# EAGLE board cs_debug_v1 (EAGLE 9.6.1), part 1 of 2
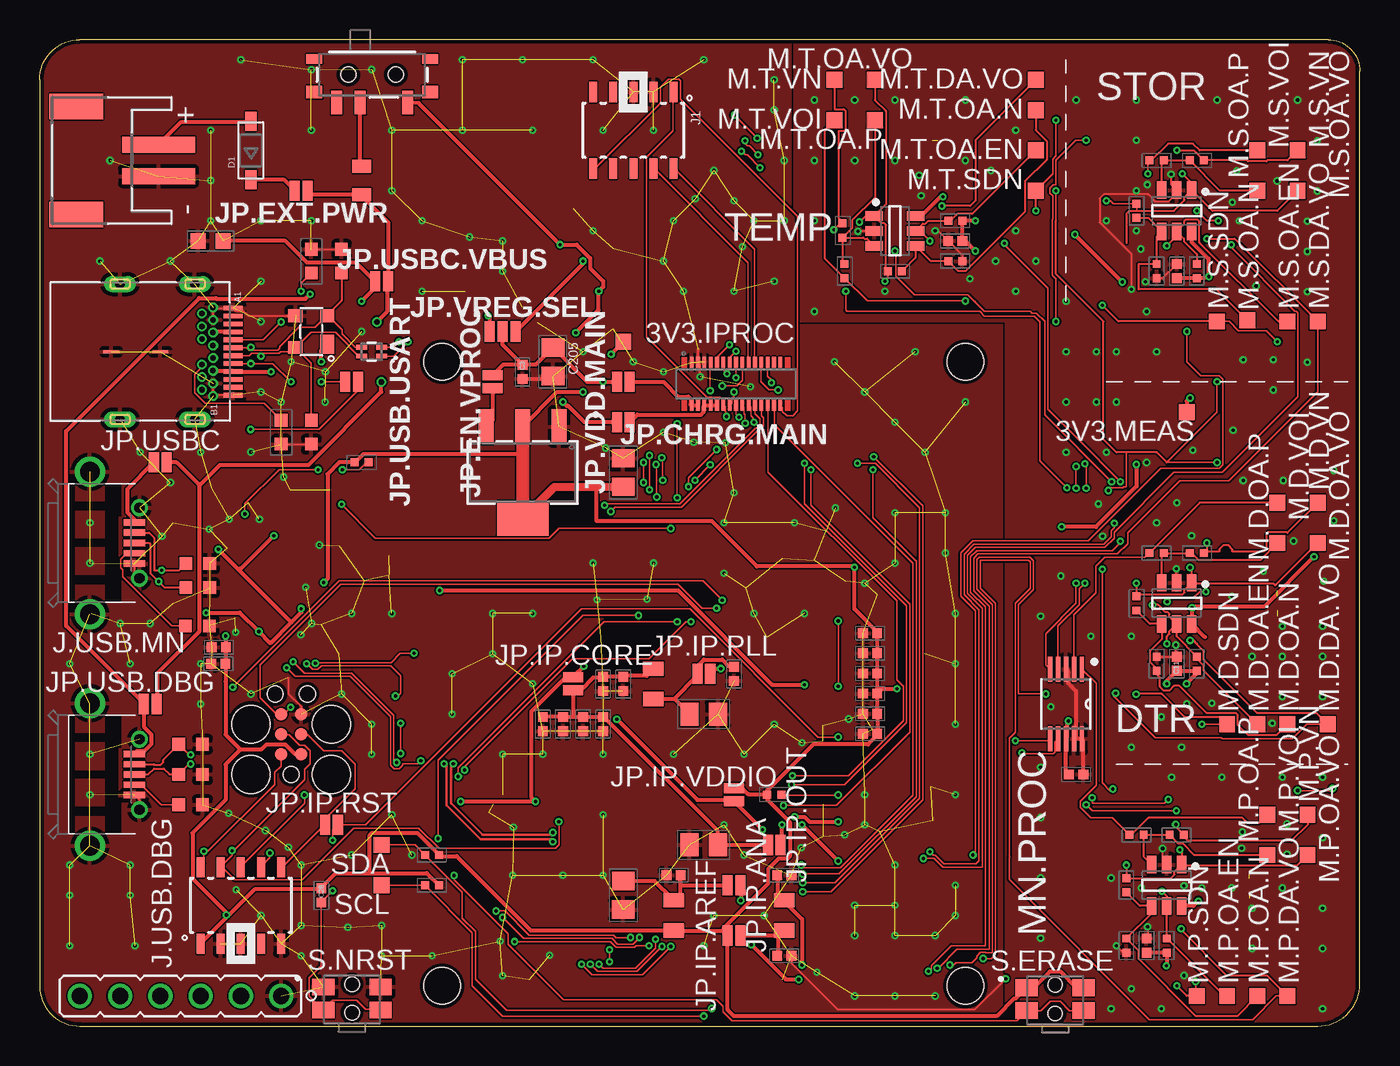
[diagram p9: board, top side]
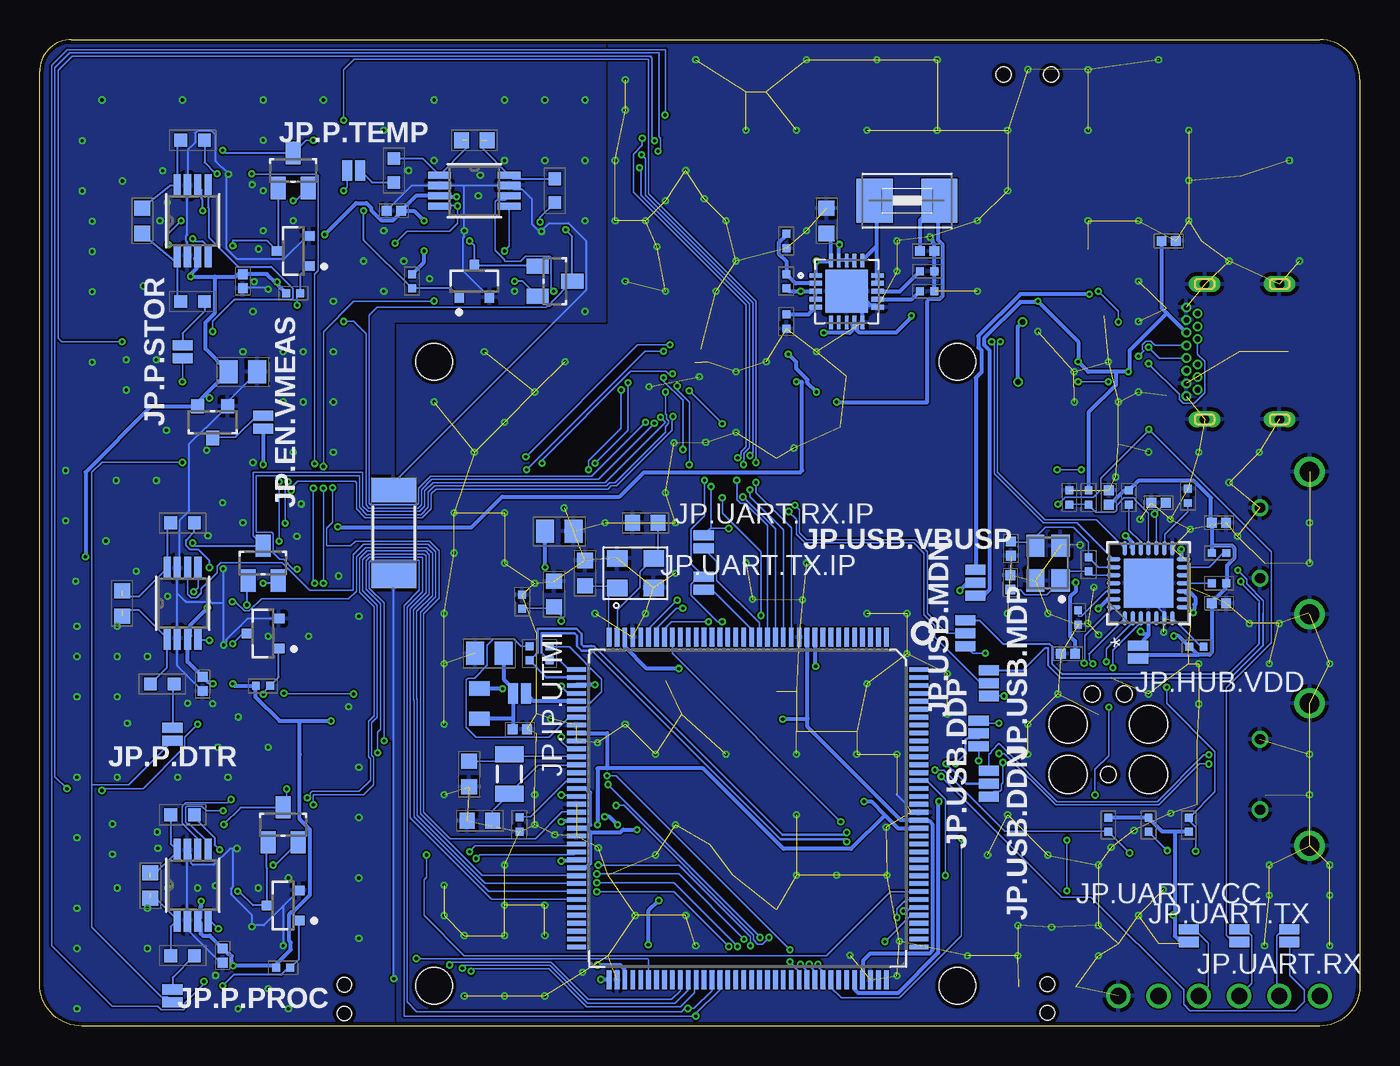
[diagram p10: board, bottom side, seen from below]

Size 83.31 x 62.23 mm. Coordinates in mm from the lower left corner, seen from the top.
Outline: 2.54,0 80.64,0 arc90 83.31,2.67 83.31,60.22 arc90 81.31,62.23 2.54,62.23 arc90 0,59.69 0,2.54 arc90 2.54,0
Copper layers (1*16): Top 0.035mm / dielectric 1.5mm / Bottom 0.035mm
Design rules "default *": minimum track width 4mil, minimum drill 0.2mm, track to track 4mil, track to pad 4mil, pad to pad 4mil, via to via 4mil, smd to smd 4mil, copper to edge 10mil, drill to drill 5mil, minimum pad ring 5mil, minimum via ring 5mil, stop-mask expansion 4mil, vias tented up to drill 0mil, thermal gap 10mil
Net classes: 1 power: width 0.254 mm; 2 power_5: width 0.254 mm; 5 10_mil: width 0.254 mm; 8 GND: width 0.127 mm
Holes 2.29 mm at 25.4,2.54 58.42,2.54 58.42,41.91 25.4,41.91
tKeepout: 4 lines

## Footprints (pad centres in the part's own frame; a part is rotated, then mirrored left to right if it is on the bottom)
TP10SQ = smd 1 x 1: TP 0,0
C0805 = smd 1.15 x 1.45: 1 -0.9,0; 2 0.9,0
C0402 = smd 0.62 x 0.62: 1 -0.45,0; 2 0.45,0
C0603 = smd 0.95 x 1: 1 -0.8,0; 2 0.8,0
SOD-123 = smd 1.2 x 0.7: A 1.85,0; C -1.85,0
SOT143_BGX50A = smd 1.2 x 0.9: 1 -0.8,-1 | smd 0.8 x 0.9: 2 1,-1; 3 1,1; 4 -1,1
1812 = smd 2.286 x 2.794: 1 -2.046,0; 2 2.046,0
SAMTECH_FTSH-105-01 = smd 0.508 x 1.27: 1 -2.54,-2.413; 2 -2.54,2.413; 3 -1.27,-2.413; 4 -1.27,2.413; 5 0,-2.413; 6 0,2.413; 7 1.27,-2.413; 8 1.27,2.413; 9 2.54,-2.413; 10 2.54,2.413
8.06.16_6-PIN_NEEDLE_ADAPTER_LEGS = smd 0.787 x 0.787: 1 -1.27,-0.635; 2 -1.27,0.635; 3 0,-0.635; 4 0,0.635; 5 1.27,-0.635; 6 1.27,0.635 | hole 0.991: -2.54,0; 2.54,1.015; 2.54,-1.015 | hole 2.375: -2.54,2.54; 0.635,2.54; 0.635,-2.54; -2.54,-2.54
HEADER-1X6 = drill 1.016: 1 0,-6.35; 2 0,-3.81; 3 0,-1.27; 4 0,1.27; 5 0,3.81; 6 0,6.35
632723X00011 = smd 0.3 x 1.2: A1 -2.75,4.58; A2 -2.25,4.58; A3 -1.75,4.58; A4 -1.25,4.58; A5 -0.75,4.58; A6 -0.25,4.58; A7 0.25,4.58; A8 0.75,4.58; A9 1.25,4.58; A10 1.75,4.58; A11 2.25,4.58; A12 2.75,4.58 | drill 0.35 pad 0.584: B1 2.8,3.33; B2 2.4,2.63; B3 1.6,2.63; B4 1.2,3.33; B5 0.8,2.63; B6 0.4,3.33; B7 -0.4,3.33; B8 -0.8,2.63; B9 -1.2,3.33; B10 -1.6,2.63; B11 -2.4,2.63; B12 -2.8,3.33; GND 2,3.33; GND1 -2,3.33 | drill 0.6 pad 1 long: Z1 -4.27,2.18; Z2 4.27,2.18; Z3 4.27,-2.55; Z4 -4.27,-2.55 | smd 0.2 x 1: Z5 0,0; Z6 0,-3.1
JST-PH-2-SMT-RA = smd 1 x 4.6: 1 1,-3.7; 2 -1,-3.7 | smd 1.6 x 3.4: NC1 -3.4,1.5; NC2 3.4,1.5
USB-THRU-ZX62D-AB-5P8 = smd 1.35 x 0.4: D+ 2.8,0; D- 2.8,0.65; GND 2.8,-1.3; USBID 2.8,-0.65; VBUS 2.8,1.3 | drill 1.25 pad 1.9: S1 0,-4.5; S2 0,4.5 | drill 0.65 pad 1.05: S3 3.125,2.225; S4 3.125,-2.225
HRS_DF40C-30DP-0.4V(51) = smd 0.23 x 0.7: 1 -2.8,1.355; 2 -2.8,-1.355; 3 -2.4,1.355; 4 -2.4,-1.355; 5 -2,1.355; 6 -2,-1.355; 7 -1.6,1.355; 8 -1.6,-1.355; 9 -1.2,1.355; 10 -1.2,-1.355; 11 -0.8,1.355; 12 -0.8,-1.355; 13 -0.4,1.355; 14 -0.4,-1.355; 15 0,1.355; 16 0,-1.355; 17 0.4,1.355; 18 0.4,-1.355; 19 0.8,1.355; 20 0.8,-1.355; 21 1.2,1.355; 22 1.2,-1.355; 23 1.6,1.355; 24 1.6,-1.355; 25 2,1.355; 26 2,-1.355; 27 2.4,1.355; 28 2.4,-1.355; 29 2.8,1.355; 30 2.8,-1.355
SMT-JUMPER_2_NC_PASTE_NO-SILK = smd 0.635 x 1.27: 1 -0.406,0; 2 0.406,0
SMT-JUMPER_2_NO_PASTEFREE_NO-SILK = smd 0.635 x 1.27: 1 -0.406,0; 2 0.406,0
SMT-JUMPER_3_1-NC_PASTE_NO-SILK = smd 0.635 x 1.27: 1 -0.813,0; 2 0,0; 3 0.813,0
0805 = smd 0.8 x 1.2: 1 -0.9,0; 2 0.9,0
IND_DLP11S_0504_MUR = smd 0.7 x 0.3: 1 -0.625,0.275; 2 0.625,0.275; 3 0.625,-0.275; 4 -0.625,-0.275
L0805 = smd 0.9 x 1.3: 1 -0.95,0; 2 0.95,0
SOT23-3_FDN340P = smd 0.95 x 1.4: D 0,1.1; G -0.95,-1.1; S 0.95,-1.1
SOT23-3_2N7002P = smd 0.6 x 0.7: D 0,1; G -0.95,-1; S 0.95,-1
R2010 = smd 1.499 x 2.794: 1 -2.667,0; 2 2.667,0
R0402 = smd 0.5 x 0.5: 1 -0.45,0; 2 0.45,0
R0603 = smd 0.8 x 0.8: 1 -0.75,0; 2 0.75,0
SWITCH_SPST_SMD_A = smd 0.7 x 1.5: 1 -2.25,-1.75; 2 -0.75,-1.75; 3 2.25,-1.75 | smd 1 x 0.6: GND1 -3.65,1; GND3 3.65,1 | smd 1 x 0.8: GND2 -3.65,-1.1; GND4 3.65,-1.1 | hole 0.95: -1.5,0; 1.5,0
SW_EVQ-P7L01P = smd 1.4 x 1.05: 1_1 -1.8,0.725; 1_2 1.8,0.725; 2_1 -1.8,-0.725; 2_2 1.8,-0.725 | hole 0.9: 0,-0.9; 0,0.9
SOT23-3_AP2120N = smd 0.8 x 0.9: GND -0.95,-1; IN 0,1; OUT 0.95,-1
DCY4 = smd 0.95 x 2.15: GND -2.3,-2.9; IN 2.3,-2.9; OUT 0,-2.9 | smd 3.25 x 2.15: OUT_TAB 0,2.9
DGK-MSOP8_INA225 = smd 1.45 x 0.45: GND -2.2,0.325; GS0 2.2,-0.975; GS1 2.2,-0.325; IN+ -2.2,0.975; IN- 2.2,0.975; OUT -2.2,-0.975; REF 2.2,0.325; VS -2.2,-0.325
OPA357AIDBVTG4 = smd 1.1 x 0.6: ENABLE 1.3,0; IN+ -1.3,-0.95; IN- 1.3,-0.95; OUT -1.3,0.95; VREF+ 1.3,0.95; VREF- -1.3,0
DGS10 = smd 1.575 x 0.279: 1 -2.2,1; 2 -2.2,0.5; 3 -2.2,0; 4 -2.2,-0.5; 5 -2.2,-1; 6 2.2,-1; 7 2.2,-0.5; 8 2.2,0; 9 2.2,0.5; 10 2.2,1
QFN50P400X400X100-21N = smd 0.81 x 0.26: 1 -1.955,1; 2 -1.955,0.5; 3 -1.955,0; 4 -1.955,-0.5; 5 -1.955,-1; 11 1.955,-1; 12 1.955,-0.5; 13 1.955,0; 14 1.955,0.5; 15 1.955,1 | smd 0.26 x 0.81: 6 -1,-1.955; 7 -0.5,-1.955; 8 0,-1.955; 9 0.5,-1.955; 10 1,-1.955; 16 1,1.955; 17 0.5,1.955; 18 0,1.955; 19 -0.5,1.955; 20 -1,1.955 | smd 2.7 x 2.7: 21 0,0
QFN28_5X5MC_MCH = smd 0.89 x 0.28: 1 -2.21,1.5; 2 -2.21,1; 3 -2.21,0.5; 4 -2.21,0; 5 -2.21,-0.5; 6 -2.21,-1; 7 -2.21,-1.5; 15 2.21,-1.5; 16 2.21,-1; 17 2.21,-0.5; 18 2.21,0; 19 2.21,0.5; 20 2.21,1; 21 2.21,1.5 | smd 0.28 x 0.89: 8 -1.5,-2.21; 9 -1,-2.21; 10 -0.5,-2.21; 11 0,-2.21; 12 0.5,-2.21; 13 1,-2.21; 14 1.5,-2.21; 22 1.5,2.21; 23 1,2.21; 24 0.5,2.21; 25 0,2.21; 26 -0.5,2.21; 27 -1,2.21; 28 -1.5,2.21 | smd 3.1 x 3.1: 29 0,0
LQFP144 = smd 0.3 x 1.2: 1 -8.75,-10.8; 2 -8.25,-10.8; 3 -7.75,-10.8; 4 -7.25,-10.8; 5 -6.75,-10.8; 6 -6.25,-10.8; 7 -5.75,-10.8; 8 -5.25,-10.8; 9 -4.75,-10.8; 10 -4.25,-10.8; 11 -3.75,-10.8; 12 -3.25,-10.8; 13 -2.75,-10.8; 14 -2.25,-10.8; 15 -1.75,-10.8; 16 -1.25,-10.8; 17 -0.75,-10.8; 18 -0.25,-10.8; 19 0.25,-10.8; 20 0.75,-10.8; 21 1.25,-10.8; 22 1.75,-10.8; 23 2.25,-10.8; 24 2.75,-10.8; 25 3.25,-10.8; 26 3.75,-10.8; 27 4.25,-10.8; 28 4.75,-10.8; 29 5.25,-10.8; 30 5.75,-10.8; 31 6.25,-10.8; 32 6.75,-10.8; 33 7.25,-10.8; 34 7.75,-10.8; 35 8.25,-10.8; 36 8.75,-10.8; 73 8.75,10.8; 74 8.25,10.8; 75 7.75,10.8; 76 7.25,10.8; 77 6.75,10.8; 78 6.25,10.8; 79 5.75,10.8; 80 5.25,10.8; 81 4.75,10.8; 82 4.25,10.8; 83 3.75,10.8; 84 3.25,10.8; 85 2.75,10.8; 86 2.25,10.8; 87 1.75,10.8; 88 1.25,10.8; 89 0.75,10.8; 90 0.25,10.8; 91 -0.25,10.8; 92 -0.75,10.8; 93 -1.25,10.8; 94 -1.75,10.8; 95 -2.25,10.8; 96 -2.75,10.8; 97 -3.25,10.8; 98 -3.75,10.8; 99 -4.25,10.8; 100 -4.75,10.8; 101 -5.25,10.8; 102 -5.75,10.8; 103 -6.25,10.8; 104 -6.75,10.8; 105 -7.25,10.8; 106 -7.75,10.8; 107 -8.25,10.8; 108 -8.75,10.8 | smd 1.2 x 0.3: 37 10.8,-8.75; 38 10.8,-8.25; 39 10.8,-7.75; 40 10.8,-7.25; 41 10.8,-6.75; 42 10.8,-6.25; 43 10.8,-5.75; 44 10.8,-5.25; 45 10.8,-4.75; 46 10.8,-4.25; 47 10.8,-3.75; 48 10.8,-3.25; 49 10.8,-2.75; 50 10.8,-2.25; 51 10.8,-1.75; 52 10.8,-1.25; 53 10.8,-0.75; 54 10.8,-0.25; 55 10.8,0.25; 56 10.8,0.75; 57 10.8,1.25; 58 10.8,1.75; 59 10.8,2.25; 60 10.8,2.75; 61 10.8,3.25; 62 10.8,3.75; 63 10.8,4.25; 64 10.8,4.75; 65 10.8,5.25; 66 10.8,5.75; 67 10.8,6.25; 68 10.8,6.75; 69 10.8,7.25; 70 10.8,7.75; 71 10.8,8.25; 72 10.8,8.75; 109 -10.8,8.75; 110 -10.8,8.25; 111 -10.8,7.75; 112 -10.8,7.25; 113 -10.8,6.75; 114 -10.8,6.25; 115 -10.8,5.75; 116 -10.8,5.25; 117 -10.8,4.75; 118 -10.8,4.25; 119 -10.8,3.75; 120 -10.8,3.25; 121 -10.8,2.75; 122 -10.8,2.25; 123 -10.8,1.75; 124 -10.8,1.25; 125 -10.8,0.75; 126 -10.8,0.25; 127 -10.8,-0.25; 128 -10.8,-0.75; 129 -10.8,-1.25; 130 -10.8,-1.75; 131 -10.8,-2.25; 132 -10.8,-2.75; 133 -10.8,-3.25; 134 -10.8,-3.75; 135 -10.8,-4.25; 136 -10.8,-4.75; 137 -10.8,-5.25; 138 -10.8,-5.75; 139 -10.8,-6.25; 140 -10.8,-6.75; 141 -10.8,-7.25; 142 -10.8,-7.75; 143 -10.8,-8.25; 144 -10.8,-8.75
XTAL_EPSON_TSX3225 = smd 1.4 x 1.15: 1 -1.1,-0.8; 2 1.1,-0.8; 3 1.1,0.8; 4 -1.1,0.8
CRYSTAL-SMD-3.2X1.5MM = smd 1 x 1.8: P$1 -1.25,0; P$2 1.25,0
CRYSTAL-3.2-2.5 = smd 1.3 x 1.05: 1 -1.15,-0.925; 2 1.15,-0.925; 3 1.15,0.925; 4 -1.15,0.925

## Placement (x,y rotation side)
3V3.IPROC  TPTP10SQ  [TP10SQ]  36.83,43.18 0 top
3V3.MEAS  TPTP10SQ  [TP10SQ]  72.39,38.73 180 top
C1  10u  [C0805]  70.48,41.27 0 bottom
C2  10u  [C0805]  36.83,34.92 90 top
C3  0.1u  [C0402]  30.48,41.27 270 top
C7  270nF  [C0603]  76.33,8.86 270 bottom
C8  0.1u  [C0402]  69.85,5.08 90 top
C9  0.1u  [C0402]  71.75,4.45 270 bottom
C10  270nF  [C0603]  78.1,26.67 270 bottom
C11  0.1u  [C0402]  71.75,22.86 90 top
C12  0.1u  [C0402]  73.03,21.59 270 bottom
C13  270nF  [C0603]  76.84,50.8 270 bottom
C14  0.1u  [C0402]  71.75,47.62 90 top
C15  0.1u  [C0402]  70.48,46.99 270 bottom
C16  0.1u  [C0402]  65.41,15.88 0 top
C17  16pF  [C0603]  45.09,31.75 180 bottom
C18  4.7u  [C0402]  27.3,48.9 0 bottom
C19  16pF  [C0603]  48.89,28.57 90 bottom
C20  270nF  [C0603]  55.88,55.88 180 bottom
C21  0.1u  [C0402]  57.78,49.53 180 top
C22  0.1u  [C0402]  46.99,4.45 0 top
C23  22u  [C0805]  41.91,11.43 180 top
C24  22u  [C0805]  41.91,19.68 0 top
C25  22u  [C0805]  36.83,8.26 270 top
C26  22u  [C0805]  54.94,23.52 180 bottom
C27  22u  [C0805]  50.52,31.22 0 bottom
C28  10n  [C0402]  17.78,8.26 270 top
C29  0.1u  [C0402]  46.99,9.53 0 top
C30  0.1u  [C0402]  36.83,21.59 270 top
C31  0.1u  [C0402]  35.56,21.59 270 top
C32  0.1u  [C0402]  34.29,19.05 270 top
C33  0.1u  [C0402]  33.02,19.05 270 top
C34  0.1u  [C0402]  31.75,19.05 270 top
C35  0.1u  [C0402]  35.56,19.05 270 top
C36  0.1u  [C0402]  43.81,22.23 270 top
C37  0.1u  [C0402]  52.4,18.44 180 top
C38  0.1u  [C0402]  52.4,19.71 180 top
C39  0.1u  [C0402]  52.4,24.79 180 top
C40  0.1u  [C0402]  52.4,23.52 180 top
C41  0.1u  [C0402]  52.4,22.25 180 top
C42  0.1u  [C0402]  52.4,20.98 180 top
C43  0.1u  [C0402]  53.01,18.72 0 bottom
C44  0.1u  [C0402]  40,9.53 180 top
C45  0.1u  [C0402]  60.96,51.44 180 bottom
C46  2.2uF  [C0603]  10.79,49.53 180 top
C47  1u  [C0402]  12.06,49.53 0 bottom
C48  0.1u  [C0402]  12.7,33.02 180 bottom
C49  0.1u  [C0402]  18.41,23.5 180 bottom
C50  0.1u  [C0402]  11.28,22.86 180 top
C51  0.1u  [C0402]  8.89,26.67 0 bottom
C52  0.1u  [C0402]  8.89,31.75 0 bottom
C53  0.1u  [C0402]  15.85,33.35 90 bottom
C54  4.7u  [C0402]  11.3,23.9 180 top
C55  18pF  [C0402]  22.05,27.99 90 bottom
C56  18pF  [C0402]  22.02,30.12 270 bottom
C103  16pF  [C0603]  55.52,12.95 180 bottom
C107  16pF  [C0603]  56.21,15.9 270 bottom
C108  10pF  [C0603]  50.85,27.25 90 bottom
C205  22u  [C0805]  32.38,41.91 270 top
C208  4.7u  [C0603]  33.66,50.8 90 bottom
D1  MBR120VLSFT3GOSCT-ND  [SOD-123]  13.33,55.24 90 top
D2  BGX50A  [SOT143_BGX50A]  17.14,43.81 90 top
F2  MF-MSMF050-2  [1812]  28.57,52.07 180 bottom
J1  J-JTAG-CORTEX_SMD  [SAMTECH_FTSH-105-01]  37.47,56.52 180 top
J2  J-JTAG-CORTEX_SMD  [SAMTECH_FTSH-105-01]  12.7,7.62 0 top
J3  J-JTAG-CORTEX-NEEDLE6-LEGS  [8.06.16_6-PIN_NEEDLE_ADAPTER_LEGS]  15.88,18.41 90 top
J4  J-SERIAL-PORT  [HEADER-1X6]  8.89,1.91 90 top
J5  J-WURTH-USBC  [632723X00011]  7.62,42.55 270 top
J19  Solar  [JST-PH-2-SMT-RA]  3.81,54.61 90 top
J.USB.DBG  J-USB-HIROSE-MICRO-USB  [USB-THRU-ZX62D-AB-5P8]  3.18,15.88 0 top
J.USB.MN  J-USB-HIROSE-MICRO-USB  [USB-THRU-ZX62D-AB-5P8]  3.18,30.48 0 top
J_DBG_TO_MAIN_HDR  HIROSE-DF40_30-PIN_CONNECTORS-HEADER  [HRS_DF40C-30DP-0.4V(51)]  43.94,40.51 0 top
JP.CHRG.MAIN  JUMPER-SMT_2_NC_PASTE_NO-SILK  [SMT-JUMPER_2_NC_PASTE_NO-SILK]  36.83,38.1 0 top
JP.EN.VMEAS  JUMPER-SMT_2_NC_PASTE_NO-SILK  [SMT-JUMPER_2_NC_PASTE_NO-SILK]  69.22,38.1 90 bottom
JP.EN.VPROC  JUMPER-SMT_2_NC_PASTE_NO-SILK  [SMT-JUMPER_2_NC_PASTE_NO-SILK]  28.57,40.64 270 top
JP.EXT.PWR  JUMPER-SMT_2_NC_PASTE_NO-SILK  [SMT-JUMPER_2_NC_PASTE_NO-SILK]  16.51,52.7 0 top
JP.HUB.VDD  JUMPER-SMT_2_NC_PASTE_NO-SILK  [SMT-JUMPER_2_NC_PASTE_NO-SILK]  14,23.6 90 bottom
JP.IP.ANA  JUMPER-SMT_2_NC_PASTE_NO-SILK  [SMT-JUMPER_2_NC_PASTE_NO-SILK]  43.81,8.89 180 top
JP.IP.AREF  JUMPER-SMT_2_NC_PASTE_NO-SILK  [SMT-JUMPER_2_NC_PASTE_NO-SILK]  43.81,5.71 0 top
JP.IP.CORE  JUMPER-SMT_2_NC_PASTE_NO-SILK  [SMT-JUMPER_2_NC_PASTE_NO-SILK]  33.66,21.59 270 top
JP.IP.OUT  JUMPER-SMT_2_NC_PASTE_NO-SILK  [SMT-JUMPER_2_NC_PASTE_NO-SILK]  46.36,11.43 180 top
JP.IP.PLL  JUMPER-SMT_2_NC_PASTE_NO-SILK  [SMT-JUMPER_2_NC_PASTE_NO-SILK]  41.91,22.23 180 top
JP.IP.RST  JUMPER-SMT_2_NC_PASTE_NO-SILK  [SMT-JUMPER_2_NC_PASTE_NO-SILK]  18.41,12.7 0 top
JP.IP.UTMI  JUMPER-SMT_2_NC_PASTE_NO-SILK  [SMT-JUMPER_2_NC_PASTE_NO-SILK]  53.04,20.98 180 bottom
JP.IP.VDDIO  JUMPER-SMT_2_NC_PASTE_NO-SILK  [SMT-JUMPER_2_NC_PASTE_NO-SILK]  43.81,14.61 90 top
JP.P.DTR  JUMPER-SMT_2_NC_PASTE_NO-SILK  [SMT-JUMPER_2_NC_PASTE_NO-SILK]  74.93,18.41 90 bottom
JP.P.PROC  JUMPER-SMT_2_NC_PASTE_NO-SILK  [SMT-JUMPER_2_NC_PASTE_NO-SILK]  74.93,1.91 90 bottom
JP.P.STOR  JUMPER-SMT_2_NC_PASTE_NO-SILK  [SMT-JUMPER_2_NC_PASTE_NO-SILK]  74.3,42.55 90 bottom
JP.P.TEMP  JUMPER-SMT_2_NC_PASTE_NO-SILK  [SMT-JUMPER_2_NC_PASTE_NO-SILK]  63.5,53.98 0 bottom
JP.UART.RX  JUMPER-SMT_2_NC_PASTE_NO-SILK  [SMT-JUMPER_2_NC_PASTE_NO-SILK]  4.45,5.71 90 bottom
JP.UART.RX.IP  JUMPER-SMT_2_NC_PASTE_NO-SILK  [SMT-JUMPER_2_NC_PASTE_NO-SILK]  41.4,30.56 270 bottom
JP.UART.TX  JUMPER-SMT_2_NC_PASTE_NO-SILK  [SMT-JUMPER_2_NC_PASTE_NO-SILK]  7.62,5.71 90 bottom
JP.UART.TX.IP  JUMPER-SMT_2_NC_PASTE_NO-SILK  [SMT-JUMPER_2_NC_PASTE_NO-SILK]  41.4,27.94 270 bottom
JP.UART.VCC  JUMPER-SMT_2_NC_PASTE_NO-SILK  [SMT-JUMPER_2_NC_PASTE_NO-SILK]  10.79,5.71 90 bottom
JP.USB.DBG  JUMPER-SMT_2_NO_PASTEFREE  [SMT-JUMPER_2_NO_PASTEFREE_NO-SILK]  6.98,20.32 180 top
JP.USB.DDN  JUMPER-SMT_3_1-NC_PASTE_NO-SILK  [SMT-JUMPER_3_1-NC_PASTE_NO-SILK]  23.42,15.29 270 bottom
JP.USB.DDP  JUMPER-SMT_3_1-NC_PASTE_NO-SILK  [SMT-JUMPER_3_1-NC_PASTE_NO-SILK]  24.05,18.47 270 bottom
JP.USB.MDN  JUMPER-SMT_3_1-NC_PASTE_NO-SILK  [SMT-JUMPER_3_1-NC_PASTE_NO-SILK]  24.89,24.79 270 bottom
JP.USB.MDP  JUMPER-SMT_3_1-NC_PASTE_NO-SILK  [SMT-JUMPER_3_1-NC_PASTE_NO-SILK]  23.42,21.64 270 bottom
JP.USB.USART  JUMPER-SMT_2_NC_PASTE_NO-SILK  [SMT-JUMPER_2_NC_PASTE_NO-SILK]  19.68,40.64 0 top
JP.USB.VBUSP  JUMPER-SMT_3_1-NC_PASTE_NO-SILK  [SMT-JUMPER_3_1-NC_PASTE_NO-SILK]  24.26,27.97 270 bottom
JP.USBC  JUMPER-SMT_2_NO_PASTEFREE  [SMT-JUMPER_2_NO_PASTEFREE_NO-SILK]  7.62,35.56 180 top
JP.USBC.VBUS  JUMPER-SMT_2_NC_PASTE_NO-SILK  [SMT-JUMPER_2_NC_PASTE_NO-SILK]  21.59,46.99 0 top
JP.VDD.MAIN  JUMPER-SMT_2_NC_PASTE_NO-SILK  [SMT-JUMPER_2_NC_PASTE_NO-SILK]  36.83,40.64 0 top
JP.VREG.SEL  JUMPER-SMT_3_1-NC_PASTE_NO-SILK  [SMT-JUMPER_3_1-NC_PASTE_NO-SILK]  29.21,43.81 0 top
L1  3.3µH/±20%/450mA  [0805]  20.32,53.34 90 top
L2  DLP11SN900HL2L  [IND_DLP11S_0504_MUR]  20.95,42.55 180 top
L101  MH2029-300Y  [L0805]  40,6.99 90 top
L102  MH2029-300Y  [L0805]  55.58,20.35 270 bottom
L103  MH2029-300Y  [L0805]  46.99,6.99 90 top
L104  MH2029-300Y  [L0805]  38.73,21.59 270 top
M.D.DA.VO  TPTP10SQ  [TP10SQ]  81.28,19.05 270 top
M.D.OA.EN  TPTP10SQ  [TP10SQ]  76.84,19.05 270 top
M.D.OA.N  TPTP10SQ  [TP10SQ]  78.74,19.05 270 top
M.D.OA.P  TPTP10SQ  [TP10SQ]  78.1,30.48 90 top
M.D.OA.VO  TPTP10SQ  [TP10SQ]  80.64,30.48 270 top
M.D.SDN  TPTP10SQ  [TP10SQ]  74.93,19.05 270 top
M.D.VN  TPTP10SQ  [TP10SQ]  80.64,33.02 270 top
M.D.VOI  TPTP10SQ  [TP10SQ]  78.1,33.02 270 top
M.P.DA.VO  TPTP10SQ  [TP10SQ]  78.74,1.91 90 top
M.P.OA.EN  TPTP10SQ  [TP10SQ]  74.93,1.91 0 top
M.P.OA.N  TPTP10SQ  [TP10SQ]  76.84,1.91 180 top
M.P.OA.P  TPTP10SQ  [TP10SQ]  77.47,10.79 90 top
M.P.OA.VO  TPTP10SQ  [TP10SQ]  80.01,10.79 90 top
M.P.SDN  TPTP10SQ  [TP10SQ]  73.03,1.91 270 top
M.P.VN  TPTP10SQ  [TP10SQ]  80.01,13.34 0 top
M.P.VOI  TPTP10SQ  [TP10SQ]  77.47,13.34 270 top
M.S.DA.VO  TPTP10SQ  [TP10SQ]  80.64,44.45 90 top
M.S.OA.EN  TPTP10SQ  [TP10SQ]  78.74,44.45 90 top
M.S.OA.N  TPTP10SQ  [TP10SQ]  76.2,44.53 90 top
M.S.OA.P  TPTP10SQ  [TP10SQ]  76.84,52.7 90 top
M.S.OA.VO  TPTP10SQ  [TP10SQ]  79.38,52.7 90 top
M.S.SDN  TPTP10SQ  [TP10SQ]  74.3,44.45 270 top
M.S.VN  TPTP10SQ  [TP10SQ]  79.38,55.24 270 top
M.S.VOI  TPTP10SQ  [TP10SQ]  76.84,55.24 90 top
M.T.DA.VO  TPTP10SQ  [TP10SQ]  62.87,59.69 180 top
M.T.OA.EN  TPTP10SQ  [TP10SQ]  62.87,55.24 180 top
M.T.OA.N  TPTP10SQ  [TP10SQ]  62.87,57.78 0 top
M.T.OA.P  TPTP10SQ  [TP10SQ]  52.7,57.15 180 top
M.T.OA.VO  TPTP10SQ  [TP10SQ]  52.7,59.69 0 top
M.T.SDN  TPTP10SQ  [TP10SQ]  62.87,52.7 0 top
M.T.VN  TPTP10SQ  [TP10SQ]  50.16,59.69 180 top
M.T.VOI  TPTP10SQ  [TP10SQ]  50.16,57.15 0 top
Q3  FDN340P  [SOT23-3_FDN340P]  67.94,12.7 0 bottom
Q4  2N7002P  [SOT23-3_2N7002P]  67.94,7.62 90 bottom
Q5  FDN340P  [SOT23-3_FDN340P]  67.31,53.98 0 bottom
Q6  2N7002P  [SOT23-3_2N7002P]  67.31,48.9 90 bottom
Q7  FDN340P  [SOT23-3_FDN340P]  69.22,29.21 0 bottom
Q8  2N7002P  [SOT23-3_2N7002P]  69.22,24.77 90 bottom
Q9  FDN340P  [SOT23-3_FDN340P]  50.8,46.99 270 bottom
Q10  2N7002P  [SOT23-3_2N7002P]  55.88,46.99 0 bottom
R1  0  [R2010]  60.96,31.11 90 bottom
R2  100k  [R0402]  10.79,12.7 270 bottom
R3  100k  [R0402]  13.33,12.7 90 bottom
R4  4.7k  [R0402]  24.77,8.89 180 top
R5  4.7k  [R0402]  24.77,10.79 180 top
R6  100k  [R0402]  15.88,12.7 90 bottom
R7  1M  [R0402]  17.12,29.13 270 bottom
R8  100k  [R0402]  53.04,12.73 270 bottom
R16  249k  [R0402]  69.22,12.06 0 top
R17  10k  [R0402]  71.75,12.06 180 top
R18  100k  [R0402]  71.12,5.08 270 top
R19  10k  [R0402]  68.58,8.89 90 top
R20  249k  [R0402]  68.58,5.08 90 top
R21  10k  [R0402]  67.94,3.68 180 bottom
R22  5.1  [R0603]  74.3,13.34 180 bottom
R23  5.1  [R0603]  74.3,4.45 180 bottom
R24  249k  [R0402]  70.48,54.61 0 top
R25  249k  [R0402]  70.48,29.84 0 top
R26  10k  [R0402]  73.03,29.84 180 top
R27  100k  [R0402]  73.03,22.86 270 top
R28  10k  [R0402]  69.22,26.67 90 top
R29  249k  [R0402]  70.48,22.86 270 top
R30  10k  [R0402]  69.22,21.46 180 bottom
R31  5.1  [R0603]  74.3,31.75 180 bottom
R32  5.1  [R0603]  75.56,21.59 180 bottom
R33  10k  [R0402]  73.03,54.61 180 top
R34  100k  [R0402]  73.03,47.62 270 top
R35  10k  [R0402]  69.22,51.44 90 top
R36  249k  [R0402]  70.48,47.62 90 top
R37  10k  [R0402]  67.31,46.23 180 bottom
R38  5.1  [R0603]  73.66,55.88 180 bottom
R39  5.1  [R0603]  73.66,45.72 180 bottom
R40  249k  [R0402]  50.8,47.62 90 top
R41  100k  [R0402]  46.36,14.61 0 top
R42  5.1k  [R0603]  17.14,48.26 270 top
R43  5.1k  [R0603]  15.24,37.47 90 top
R44  10k  [R0402]  8.89,27.94 0 bottom
R45  10k  [R0402]  10.31,23.93 180 bottom
R46  100k  [R0402]  18.34,33.35 270 bottom
R47  100k  [R0402]  17.12,33.35 90 bottom
R48  12k  [R0402]  17.78,25.78 90 bottom
R49  100k  [R0402]  20.32,35.56 180 top
R50  100k  [R0402]  10.85,33.45 270 bottom
R51  10k  [R0402]  14.58,33.35 90 bottom
R52  10k  [R0402]  8.89,29.84 180 bottom
R53  10k  [R0402]  50.67,50.19 270 top
R54  100k  [R0402]  57.78,50.8 0 top
R55  10k  [R0402]  53.97,47.62 180 top
R56  249k  [R0402]  57.78,48.26 180 top
R57  10k  [R0402]  59.82,46.99 90 bottom
R58  5.1  [R0603]  50.8,52.7 90 bottom
R59  5.1  [R0603]  60.96,53.98 90 bottom
R101  39  [R0402]  52.4,23.52 90 bottom
R102  39  [R0402]  51.13,23.52 90 bottom
R103  6.8k  [R0402]  52.86,26.77 270 bottom
R201  270k  [R0402]  36.2,46.99 270 bottom
R202  100k  [R0402]  36.2,49.53 90 bottom
R203  2k  [R0402]  27.3,47.62 180 bottom
R204  100k  [R0402]  27.3,46.35 180 bottom
R206  10k  [R0402]  36.2,44.45 90 bottom
S201  [SWITCH_SPST_SMD_A]  20.98,60.02 0 top
S.ERASE  Momentary  [SW_EVQ-P7L01P]  64.08,1.7 0 top
S.NRST  Momentary  [SW_EVQ-P7L01P]  19.71,1.75 0 top
SCL  TPTP10SQ  [TP10SQ]  21.59,8.89 180 top
SDA  TPTP10SQ  [TP10SQ]  21.59,11.43 180 top
U1  AP2120N-3.3TRG1  [SOT23-3_AP2120N]  72.39,38.1 180 bottom
U2  TLV1117LV33DCYR  [DCY4]  30.48,34.92 180 top
U5  INA225AIDGK  [DGK-MSOP8_INA225]  73.66,8.89 90 bottom
U6  OPA357AIDBVTG4  [OPA357AIDBVTG4]  71.12,8.89 270 top
U7  INA225AIDGK  [DGK-MSOP8_INA225]  74.3,26.67 90 bottom
U8  OPA357AIDBVTG4  [OPA357AIDBVTG4]  71.75,26.67 270 top
U9  INA225AIDGK  [DGK-MSOP8_INA225]  73.66,50.8 90 bottom
U10  OPA357AIDBVTG4  [OPA357AIDBVTG4]  71.75,51.44 270 top
U11  DAC7574IDGS  [DGS10]  64.77,20.32 270 top
U12  MCP73871T-2CCI/ML  [QFN50P400X400X100-21N]  32.38,46.35 0 bottom
U13  USB2412-DZK  [QFN28_5X5MC_MCH]  13.33,27.94 90 bottom
U14  INA225AIDGK  [DGK-MSOP8_INA225]  55.88,52.7 0 bottom
U15  OPA357AIDBVTG4  [OPA357AIDBVTG4]  53.97,50.16 0 top
U_INSTR_PROC  ATSAM3X8EA-AU  [LQFP144]  38.63,13.74 180 bottom
VR1  VARISTOR  [R0603]  9.52,13.97 0 top
VR2  VARISTOR  [R0603]  9.52,15.88 0 top
VR3  VARISTOR  [R0603]  19.05,48.26 90 top
VR4  VARISTOR  [R0603]  17.14,37.47 270 top
VR5  VARISTOR  [R0603]  9.52,17.78 0 top
VR6  VARISTOR  [R0603]  9.96,25.25 0 top
VR7  VARISTOR  [R0603]  9.98,27.66 0 top
VR8  VARISTOR  [R0603]  9.98,29.18 0 top
Y1  EPSON_TSX-3225_24.0000MF10Z-C3  [XTAL_EPSON_TSX3225]  19.68,29.21 90 bottom
Y101  32.768kHz  [CRYSTAL-SMD-3.2X1.5MM]  53.67,15.9 270 bottom
Y102  12mHz-12pF-K7  [CRYSTAL-3.2-2.5]  45.72,28.57 0 bottom

## Tracks (layer width: path | path; a pad name or v marks a point on that pad's centre or on a via)
3V3_INSTR_MEAS  (via drill 0.2)
  Top 0.254: U10.VREF+ 72.7,49.47 73.76,48.41 73.76,47.41 | 73.76,47.41 73.56,47.22 73.03,47.22 R34.2 C14.1 | 73.76,47.41 73.77,47.4 v73.77,47.29 | C8.1 R18.2 71.12,3.84 v71.09,3.81 | v73.12,7.89 72.82,7.59 U6.VREF+ | R27.2 C11.1 71.12,21.77 v71.12,21.59 | R27.2 73.03,22.45 | 73.53,24.55 U8.VREF+ 72.72,25.39 v72.72,26.39 72.8,26.47 77.27,26.47 v80.42,29.62 | R27.2 73.03,22.26 v72.37,21.61 | v59.05,48.9 58.42,49.53 C21.1 R54.2 v59.05,50.8 | C16.1 64.77,16.06 U11.8 64.82,18.24 64.82,19.15 v64.92,19.25 | v57,52.32 56.84,52.32 55.68,51.16 55.32,51.16 U15.VREF+ | 3V3.MEAS.TP 72.39,39.42 v72.59,39.62 | v68.33,46.94 v65.33,49.94
  Bottom 0.254: 73.51,48.43 U9.VS 73.46,48.41 73.41,48.33 73.41,47.79 73.77,47.43 v73.77,47.29 72.24,47.29 | R37.2 68.4,46.87 | 68.4,46.87 68.97,47.44 C15.1 70.64,47.59 70.94,47.29 72.24,47.29 | v71.09,3.81 71.1,3.83 | 71.1,3.83 71.19,3.91 71.19,4.41 71.34,4.56 71.42,4.56 C9.1 72.57,5.71 73.02,5.71 73.16,5.86 73.16,6.52 U5.VS 73.16,6.86 73.16,7.52 73.12,7.57 v73.12,7.89 | 71.1,3.83 68.54,3.83 R21.2 68.43,3.86 67.46,4.83 67.46,5.28 67.56,5.38 67.56,7.06 67.41,7.21 67.31,7.21 66.24,8.28 66.24,12.39 66.9,13.06 66.9,17.14 66.9,19.25 | v71.12,21.59 70.99,21.46 R30.2 69.7,21.39 69.7,20.78 68.17,19.25 66.9,19.25 | v72.72,26.39 v72.72,26.38 73.8,25.3 73.8,24.64 U7.VS 73.97,22.98 C12.1 72.69,21.7 72.61,21.7 72.51,21.61 v72.37,21.61 | R57.2 59.05,48.2 v59.05,48.9 | C45.1 59.56,52.38 U14.VS 57.96,52.32 v57,52.32 | C45.1 59.69,51.44 v59.05,50.8 | 66.9,19.25 v64.92,19.25 | 72.82,39.85 71.42,41.25 C1.1 71.48,41.35 72.85,42.72 72.85,44.4 72.24,45.01 72.24,47.29 | 72.82,39.85 73.3,39.37 73.3,39.12 U1.OUT 73.46,39.06 76.3,39.06 80.42,34.95 v80.42,29.62 | 72.82,39.85 v72.59,39.62 | v65.33,49.94 63.35,51.92 62.69,51.92 62.38,51.61 62.38,51.46 61.77,50.85 61.01,50.85 60.6,51.26 60.6,51.36 C45.1 | v68.33,46.94 68.4,46.87
3V3_INSTR_PROC  (via drill 0.2)
  Top 0.254: S.ERASE.1_2 65.43,2.43 64.43,3.43 63.74,3.43 62.73,2.43 S.ERASE.1_1 61.59,1.73 61.49,1.73 60.39,0.64 43.81,0.64 43.41,1.04 JP.IP.AREF.1 | U2.OUT 32.66,40.01 v34.29,40.01 | 3V3.IPROC.TP 36.83,43.16 v36.07,42.39 | U2.OUT_TAB 30.48,31.11 | JP.IP.AREF.1 43.13,5.99 40.03,5.99 L101.1 39.88,6.04 30.99,6.04 26.31,10.72 25.3,10.72 R5.1 25.2,10.82 23.82,12.19 20.98,12.19 20.83,12.04 20.83,9.65 | R41.1 45.87,14.63 44.7,14.63 44.35,14.99 43.84,14.99 JP.IP.VDDIO.2 | C42.1 52.88,20.98 52.88,19.81 C38.1 52.88,19.71 52.88,18.44 C37.1 52.83,18.34 52.27,17.78 48.82,17.78 45.92,14.88 45.92,14.73 R41.1 | C42.1 52.88,21.08 52.88,22.25 C41.1 52.88,22.35 52.88,23.52 C40.1 52.88,23.62 52.88,24.79 C39.1 52.83,24.89 51.41,26.31 v51.41,28.96 51.31,29.01 45.26,29.01 42.42,31.85 35.15,31.85 35.15,34.02 | v54.1,21.29 52.98,21.29 C42.1 | JP.IP.AREF.1 43.18,6.1 43.18,6.2 45.97,8.99 45.97,9.91 46.63,10.57 47.19,10.57 47.35,10.72 47.35,12.85 45.92,14.28 45.92,14.48 R41.1 | 20.83,9.65 18.69,9.65 17.78,8.74 C28.1 17.68,8.64 13.56,8.64 11.86,6.93 | 20.83,9.65 24.43,9.65 25.2,8.89 R4.1 | 11.86,6.93 10.16,5.23 J2.1 | 11.86,6.93 v11.79,7.01 11.73,7.11 11.73,7.21 9.65,9.3 9.65,12.19 11.73,14.28 11.73,16.51 12.6,17.37 12.65,17.48 | 30.48,36.07 20.42,36.07 19.91,35.56 R49.2 18.9,35.56 18.16,34.82 18.16,28.22 v17.93,27.99 17.88,27.89 | 12.65,17.48 14.02,17.48 14.33,17.78 15.49,17.78 16.1,17.17 16.51,17.17 J3.1 | 12.65,17.48 11.73,18.39 11.73,21.74 11.73,21.75 C50.1 11.75,22.89 C54.1 11.73,23.92 v11.73,24.61
  Top 0.508: U2.OUT_TAB 32.48,34.02 35.15,34.02 C2.1
  Top 0.813: U2.OUT 30.48,36.07 U2.OUT_TAB
  Bottom 0.254: v34.29,40.01 34.85,40.56 34.85,40.76 35.56,41.47 35.56,41.88 v36.07,42.39 | v54.1,21.29 55.58,21.29 L102.1 | v51.41,28.96 51.41,31.2 C27.1 | 11.68,12.29 12.5,12.29 13.31,13.11 R3.2 13.46,13.16 15.85,13.16 R6.2 | 11.68,12.29 10.82,12.29 R2.2 | 11.68,12.29 11.68,7.01 | 11.68,7.01 11.68,5.69 11.33,5.33 10.82,5.33 JP.UART.VCC.1 | v11.79,7.01 11.68,7.01 | C51.1 9.3,26.67 9.3,26.77 8.48,27.58 8.48,27.94 R44.2 8.38,28.04 8.38,29.06 7.92,29.52 7.92,30.18 8.08,30.33 9.35,30.33 | 9.4,26.82 C51.1 | C53.1 15.85,32.92 15.75,32.92 14.88,33.78 14.58,33.78 R51.2 13.99,34.39 10.46,34.39 9.4,33.33 9.4,31.85 C52.1 9.35,30.33 | 9.35,30.33 9.35,29.87 R52.2 9.45,29.77 | 10.21,23.42 10.67,23.88 R45.2 11.45,24.61 v11.73,24.61 | 10.21,23.42 9.5,23.42 9.35,23.57 9.35,26.57 C51.1 | v17.93,27.99 17.93,27.43 18.29,27.08 18.29,24.59 17.98,24.28 17.98,23.52 C49.1 | JP.HUB.VDD.1 13.77,23.42 10.21,23.42
ADVREF  (via drill 0.2)
  Top 0.254: C29.1 46.58,9.5 46.58,8.38 46.99,7.98 L103.2 47.04,7.82 48.11,6.76 v48.11,3.86
  Bottom 0.254: v48.11,3.86 46.69,3.86 46.43,3.61 46.43,2.95 U_INSTR_PROC.75
ADVREF_PRE
  Top 0.254: C22.1 46.58,4.47 46.58,5.59 46.99,5.99 L103.1 46.53,5.69 44.25,5.69 JP.IP.AREF.2
AGND  (via drill 0.2)
  Top 0.127: C14.2 70.85,47.17 R36.1 | v71.4,53.75 71.4,53.09 U10.VREF- 71.73,52.68 71.73,52.53 71.22,52.02 70.41,52.02 69.95,52.48 67.16,52.48 66.9,52.22 66.9,50.7 68.88,48.72 v68.88,46.48 | v67.94,5.08 68.39,4.63 R20.1 | v69.92,6.28 69.92,5.6 C8.2 69.85,5.61 | U6.VREF- 70.87,10.44 v70.87,11.2 | R29.1 C11.2 71.7,23.36 v71.7,24.04 | U8.VREF- 71.73,28 v71.73,28.85 | U15.VREF- 52.64,50.13 v51.63,50.13 | R56.1 58.23,48.63 C21.2 56.7,50.16 v56.52,50.16
  Top 0.254: C16.2 65.85,18.04 U11.10 65.41,18.12 | 65.41,18.12 U11.9 | U11.3 64.9,22.39 64.9,21.64 65.41,21.14 65.41,18.12
  Bottom 0.127: Q4.S 67.94,7.57 | 67.94,7.57 v67.94,5.08 | 67.94,7.57 69.16,6.35 69.85,6.35 v69.92,6.28 69.92,7.02 71.23,8.34 71.23,8.68 71.12,8.79 71.12,11.2 | v70.87,11.2 71.12,11.2 | 71.12,11.2 71.29,11.2 72.32,10.18 73.64,10.18 73.75,10.29 73.75,10.86 U5.REF U5.GND 73.97,6.66 73.97,6.1 71.88,4.01 71.78,4.01 C9.2 | 74.62,27.3 U7.GND 74.62,22.73 C12.2 | 74.62,27.3 U7.REF 74.57,28.91 74.47,29.01 74.47,31.9 73.86,32.51 73.86,36.73 72.85,37.74 72.8,37.74 71.48,39.06 U1.GND 71.42,39.12 71.42,39.42 69.6,41.25 C1.2 | v71.7,24.04 71.75,24.04 71.73,24.07 | 71.73,24.07 71.54,24.25 71.54,24.36 70.18,25.71 Q8.S | v71.73,28.85 71.73,26.67 | 71.73,26.67 71.73,24.07 | 71.73,26.67 72.41,26.67 72.55,26.81 72.57,26.78 74.1,26.78 74.12,26.81 74.62,27.3 | 56.52,53.03 U14.GND 59.81,53.03 C45.2 | 56.52,53.03 U14.REF 53.45,52.8 52.88,52.8 52.26,52.18 52.26,50.6 51.79,50.13 v51.63,50.13 51.61,50.19 51.16,50.65 49.94,50.65 48.82,49.53 48.82,46.43 60.96,34.29 R1.2 | 56.52,53.03 v56.52,50.16 56.52,49.78 56.6,49.7 56.6,47.66 Q10.S | U9.GND 73.98,49.45 74.05,49.52 74.05,49.84 73.98,49.91 U9.REF 73.97,53.03 73.97,55.27 73.51,55.73 73.51,56.34 73.35,56.49 72.44,56.49 72.19,56.24 72.19,54.56 71.42,53.8 v71.4,53.75 71.42,53.75 71.53,53.65 71.53,49.07 70.87,48.41 67.87,48.41 66.45,49.84 66.34,49.84 Q6.S | v68.88,46.48 69.01,46.61 70.44,46.61 C15.2
  other vias: 48.89,45.09 53.34,46.35 58.7,47.14 61.59,46.35 60.33,48.26 61.59,50.16 62.87,48.26 55.63,52.37 55.5,53.67 48.89,50.8 48.89,54.61 48.89,58.42 51.44,58.42 51.44,54.61 53.97,54.61 53.97,58.42 58.42,58.42 58.42,54.61 60.02,53.98 61.59,56.52 65.41,58.42 69.22,58.42 74.3,58.42 79.38,58.42 69.22,55.88 69.22,52.7 69.22,50.16 67.31,50.8 64.77,45.72 64.77,42.55 64.77,39.37 64.77,36.2 67.31,36.2 66.67,39.37 66.67,42.55 67.94,42.55 70.48,42.55 67.94,39.37 69.85,35.56 71.75,33.02 70.48,31.75 67.08,30.91 63.17,25.86 63.8,20.14 63.17,16.33 63.17,13.16 63.17,9.35 63.17,5.54 67.61,1.09 70.79,1.09 68.88,2.36 72.21,3.2 80.95,1.09 80.95,4.9 76.5,4.9 76.5,7.44 80.95,7.44 78.41,8.71 75.23,8.71 72.21,8.86 69.52,8.71 73.33,8.71 67.61,9.35 75.9,12.24 75.84,11.23 78.71,10.85 78.71,12.75 80.95,11.89 80.95,15.7 78.41,15.7 74.6,15.7 71.42,15.7 68.88,17.6 72.06,17.6 70.79,19.51 72.39,20.35 77.77,19.1 73.96,20.37 78.41,20.78 78.41,23.32 78.41,25.22 80.95,25.22 80.95,23.32 80.95,20.78 76.5,23.32 75.23,27.13 68.88,24.59 66.34,24.59 64.44,28.4 72.69,30.94 77.22,28.7 79.12,30.61 81.03,28.07 81.66,31.88 81.66,35.05 78.49,34.42 75.95,34.42 75.31,37.59 72.77,36.32 77.85,40.13 77.85,42.04 75.95,42.04 79.98,41.88 79.98,46.33 79.98,48.87 79.98,50.77 80.62,52.68 80.62,55.85 78.08,53.31 75.54,53.95 69.9,53.09 69.49,49.02 76.76,46.69 69.85,45.09 75.72,50.8 75.26,51.97 69.77,46.96 66.8,32.94
  pour Top: 60.96,0 83.19,0 83.19,62.23 47.62,62.23 47.62,44.45 60.96,44.45
  pour Bottom: 60.96,0 83.19,0 83.19,62.23 47.62,62.23 47.62,44.45 60.96,44.45
BAT_CHG_PROG1
  Bottom 0.254: U12.13 29.02,46.35 R203.2
CC3  (via drill 0.2)
  Top 0.102: J5.A5 14.11,43.3 v15.24,44.42 | v16.51,46.35 16.51,46.88 R42.2
  Bottom 0.102: v15.24,44.42 15.24,45.09 v16.51,46.35
CC4
  Top 0.102: J5.B5 10.25,41.59 9.8,41.13 9.8,39.96 10.46,39.29 14.16,39.29 R43.2
CHG_VPCC
  Bottom 0.254: R202.2 36.2,49.9 36.67,49.42 36.67,48.73 36.2,48.26 R201.1 35.61,46.85 U12.2
CM_DIFFAMP_N1  (1 unrouted)
  Bottom 0.127: 55.43,55.88 55.43,55.43 U14.IN- 53.45,53.45 R58.2
CM_DIFFAMP_N2
  Bottom 0.127: R38.2 74.63,55.66 U9.IN- 75.09,53 C13.1
CM_DIFFAMP_N3  (1 unrouted)
  Bottom 0.127: 78.1,27.12 77.02,27.12 U7.IN- 75.27,31.52 R31.2
CM_DIFFAMP_N4  (1 unrouted)
  Bottom 0.127: R22.2 75.05,11.5 U5.IN- 74.63,11.01 76.33,9.31
CM_DIFFAMP_P1  (1 unrouted)
  Bottom 0.127: R59.2 59.12,54.73 U14.IN+ 56.33,55.43 56.33,55.88
CM_DIFFAMP_P2
  Bottom 0.127: U9.IN+ 74.63,48.26 | 74.63,48.26 74.63,45.95 R39.2 | C13.2 74.75,48.26 74.63,48.26
CM_DIFFAMP_P3  (1 unrouted)
  Bottom 0.127: 78.1,26.22 77.02,26.22 U7.IN+ 75.27,22.64 R32.2
CM_DIFFAMP_P4  (1 unrouted)
  Bottom 0.127: 76.33,8.41 74.63,6.72 U5.IN+ 75.05,6.28 R23.2
CM_DTR_DCBIAS_SHUTDOWN  (via drill 0.2)
  Top 0.102: M.D.SDN.TP v73.33,19.05 | v79.38,14.86 81.35,14.86 81.41,14.81 v81.59,14.99 | v38.94,33.38 38.94,35.43 v38.89,35.43 | v45.47,54.15 44.65,54.97 44.53,54.97 v44.3,55.19
  Top 0.127: v69.19,20.93 69.22,20.95 70.81,20.95 72.27,19.49 74.49,19.49 M.D.SDN.TP
  Bottom 0.102: v73.33,19.05 74.14,18.24 74.14,17.63 76.78,14.99 79.25,14.99 v79.38,14.86 | v81.59,14.99 82.35,15.75 82.35,60.45 81.41,61.39 44.22,61.39 | 44.2,61.39 44.22,61.39 | v38.94,33.38 38.89,33.38 36.88,31.37 U_INSTR_PROC.15 | v38.89,35.43 38.86,35.46 38.86,36.15 38.53,36.48 38.53,45.58 45.36,52.41 45.36,54.05 v45.47,54.15 | 44.22,61.39 44.22,56.11 44.12,56.01 44.12,55.37 v44.3,55.19
  Bottom 0.127: Q8.G 68.22,22.01 R30.1 69.19,21.03 v69.19,20.93
CM_DTR_DIFFAMP_GAIN0  (via drill 0.2)
  Top 0.102: v71.14,26.77 71.39,27.01 72.81,27.01 73.21,27.41 v73.58,27.41
  Bottom 0.102: U_INSTR_PROC.64 49.46,9.02 55.2,9.02 59.49,13.3 59.49,20.63 59.51,20.66 59.51,26.17 58.52,27.16 58.52,29.83 58.88,30.19 62.73,30.19 63.32,29.6 63.32,27.43 63.8,26.95 69.31,26.95 70.07,26.19 70.39,26.19 70.89,26.7 71.07,26.7 v71.14,26.77 | v73.58,27.41 73.32,27.67 U7.GS0
CM_DTR_DIFFAMP_GAIN1
  Bottom 0.102: U_INSTR_PROC.63 49.46,9.52 55.39,9.52 56.72,10.85 | 56.74,10.85 56.72,10.85 | 56.72,10.85 59.28,13.41 59.28,26.11 58.32,27.07 58.32,29.91 58.8,30.39 62.87,30.39 63.52,29.73 63.52,27.52 63.53,27.51 66.28,27.51 68,29.23 71.89,29.23 72.11,29.01 72.11,28.6 73.12,27.59 73.12,27.31 | 73.33,27.05 73.33,27.1 73.12,27.31 | 73.12,27.31 73.14,27.31 73.43,27.03 73.74,27.03 73.96,27.25 U7.GS1
CM_DTR_DIFFAMP_OUT  (via drill 0.2)
  Top 0.102: v57.45,3.86 57.7,3.86 57.82,3.99 58.83,3.99 59.16,4.32 59.16,4.42 59.38,4.65 59.7,4.65 59.71,4.63 60.12,4.63 60.12,26.59 59.16,27.55 59.16,29.45 59.3,29.59 62.49,29.59 62.71,29.37 62.71,27.53 61.77,26.59 61.77,20.95 v63.5,20.95 | M.D.DA.VO.TP 79.96,19.05 79.05,18.14 74.62,18.14 74.56,18.2 70.4,18.2 67.74,20.85 v67.89,21.01
  Top 0.127: M.D.DA.VO.TP 80.59,19.74 76.84,19.74 73.47,23.11 73.47,23.64 73.03,24.08 73.03,24.13 72.82,24.33 v72.59,24.33
  Bottom 0.102: U_INSTR_PROC.82 42.88,2.25 43.42,1.71 48.7,1.71 51.03,4.04 57.27,4.04 v57.45,3.86 | v67.89,21.01 67.84,20.95 v63.5,20.95
  Bottom 0.127: v72.59,24.33 73.18,24.33 U7.OUT
CM_DTR_V_OFFSET_IN
  Top 0.102: U11.2 65.28,22.55 65.28,25.96 66.65,27.33 66.65,29.01 67.21,29.57 69.75,29.57 70,29.82 R25.1
  Top 0.127: M.D.VOI.TP 73.21,33.02 R25.1
CM_DTR_V_SENSE_N  (via drill 0.2)
  Top 0.102: v44.13,38.42 43.94,38.61 J_DBG_TO_MAIN_HDR.16
  Top 0.127: v73.66,30.48 73.66,30.03 73.57,29.94 | 73.57,29.94 R26.1 | M.D.VN.TP 78.74,31.11 78.68,31.17 77.53,31.17 77.41,31.06 77.41,30.15 77.2,29.94 75.27,29.94 75.27,30.08 75.03,30.32 74.68,30.32 74.44,30.08 74.44,29.94 73.57,29.94
  Bottom 0.102: v44.13,38.42 43.81,38.1 47.62,34.29 58.48,34.29 59,33.77 59,32.8 59.33,32.47 62.59,32.47 62.92,32.8 62.92,34.92 69.85,34.92 69.85,30.95 Q7.D
  Bottom 0.127: Q7.D 73.49,30.31 v73.66,30.48
CM_DTR_V_SENSE_P
  Bottom 0.127: R32.1 74.93,21.48 JP.P.DTR.2
CM_OPAMP_ENABLE1  (via drill 0.2)
  Top 0.127: v56.18,49.53 55.54,50.16 U15.ENABLE 55.73,50.62 55.9,50.62 56.08,50.8 R54.1 57.47,50.8 57.91,51.24 58.86,51.24 M.T.OA.EN.TP
  Bottom 0.127: Q9.G 51.95,47.99 Q10.D 55.88,49.23 v56.18,49.53
CM_OPAMP_ENABLE2  (via drill 0.2)
  Top 0.127: U10.ENABLE 72.22,49.67 72.22,49.51 73.03,48.7 R34.1 | v71.12,49.23 71.75,49.87 U10.ENABLE | M.S.OA.EN.TP 78.17,44.45 73.2,49.42 73.2,50.76 73.08,50.88 72.33,50.88 72.22,50.76 72.22,50.59 U10.ENABLE
  Bottom 0.127: v71.12,49.23 71.12,49.53 68.94,49.53 Q6.D 68.26,48.95 Q5.G
CM_OPAMP_ENABLE3  (via drill 0.2)
  Top 0.127: U8.ENABLE 71.75,24.58 R27.1 73.03,23.18 73.47,22.74 73.47,22.42 M.D.OA.EN.TP | U8.ENABLE 71.3,24.91 71.3,24.74 71.12,24.57 v71.12,24.13 | U8.ENABLE 71.3,25.83 71.3,26 71.18,26.11 71.04,26.11 70.59,26.57 v70.23,26.57
  Bottom 0.127: Q8.D 70.48,24.77 v71.12,24.13 | v70.23,26.57 70.23,28.04 Q7.G
CM_OPAMP_ENABLE4  (via drill 0.2)
  Top 0.127: v70.81,8.51 71.12,8.2 U6.ENABLE R18.1 74.75,1.91 M.P.OA.EN.TP
  Bottom 0.127: v70.81,8.51 70.74,8.51 69.85,7.62 Q4.D 68.94,9.94 69,9.99 69,11.5 Q3.G
CM_OPAMP_N1
  Top 0.127: R55.1 55.27,48.48 U15.IN- 56.23,48.26 R56.2 57.97,47.62 58.42,47.62 62.17,51.38 62.17,53.28 63.56,54.66 63.56,55.82 62.87,56.51 M.T.OA.N.TP
CM_OPAMP_N2
  Top 0.127: R35.1 69.95,50.98 U10.IN- 70.48,49.81 R36.2 69.36,48.08 69.36,46.47 74.25,46.47 M.S.OA.N.TP
CM_OPAMP_N3
  Top 0.127: R28.1 70.06,25.37 U8.IN- 70.81,24.4 70.04,23.64 70.04,22.98 70.48,22.54 R29.2 70.48,22.23 | M.D.OA.N.TP 78.05,18.36 76.26,18.36 76.2,18.41 75.62,18.99 75.62,19.63 75.51,19.74 73.65,19.74 71.93,21.46 71.58,21.46 71.29,21.17 70.95,21.17 70.7,21.42 70.7,22.01 70.48,22.23 | 70.48,22.18 70.48,22.23
CM_OPAMP_N4
  Top 0.127: R19.1 69.43,7.59 U6.IN- 70.17,7.12 R20.2 69.35,4.76 69.35,4.24 72.96,0.64 75.56,0.64 M.P.OA.N.TP
CM_OPAMP_OUT1  (via drill 0.2)
  Top 0.127: U15.OUT 53.13,50.66 53.3,50.66 53.41,50.54 53.41,47.73 R55.2 53.52,47.17 v53.34,46.99 | v51.74,50.72 52.13,51.12 U15.OUT | M.T.OA.VO.TP 52.7,58.42 53.39,57.73 53.39,51.84 U15.OUT
  Bottom 0.127: Q9.S 52.85,46.99 v53.34,46.99 | R58.1 51.74,51.02 v51.74,50.72
CM_OPAMP_OUT2  (via drill 0.2)
  Top 0.102: v67.31,52.07 67.56,52.07 67.75,51.88 R35.2 69.24,51.87 69.24,51.44
  Top 0.127: v72.11,53.77 72.7,53.17 U10.OUT | 68.58,49.4 68.58,51.25 68.77,51.44 69.24,51.44 71.58,51.44 72.25,52.11 72.25,52.28 U10.OUT | M.S.OA.VO.TP 78.1,51.44 74,51.44 U10.OUT
  Bottom 0.102: v67.31,52.07 67.16,52.07 Q5.S
  Bottom 0.127: R38.1 72.91,54.49 72.19,53.77 v72.11,53.77
CM_OPAMP_OUT3  (via drill 0.2)
  Top 0.127: v69.22,27.94 R28.2 69.33,27.23 72.13,27.23 72.25,27.34 72.25,27.51 72.53,27.8 | 72.53,27.8 U8.OUT 72.7,28.82 v72.59,28.93 | M.D.OA.VO.TP 77.96,27.8 77.86,27.9 72.63,27.9 72.53,27.8
  Bottom 0.127: Q7.S 68.44,27.94 v69.22,27.94 | v72.59,28.93 72.59,29.36 73.29,30.06 73.83,30.06 74.08,30.31 74.08,30.65 73.55,31.18 R31.1
CM_OPAMP_OUT4  (via drill 0.2)
  Top 0.127: U6.OUT 71.61,9.73 71.61,9.56 71.39,9.34 R19.2 v68.58,10.16 | v71.96,11.12 72.07,11.01 U6.OUT | M.P.OA.VO.TP 79.32,10.1 72.07,10.1 U6.OUT
  Bottom 0.127: v71.96,11.12 72.27,11.44 72.27,11.89 73.55,13.17 R22.1 | Q3.S 68.44,10.16 v68.58,10.16
CM_OPAMP_P1
  Top 0.127: R53.2 50.67,48.2 R40.2 | R53.2 51.98,49.74 52.05,49.67 52.22,49.67 U15.IN+ | R53.2 51.27,50.34 51.27,50.83 52.7,52.26 M.T.OA.P.TP
CM_OPAMP_P2
  Top 0.127: U10.IN+ 70.81,54.48 R24.2 R33.2 74.48,52.7 M.S.OA.P.TP
CM_OPAMP_P3
  Top 0.127: U8.IN+ 70.81,29.71 R25.2 R26.2 72.71,29.84 73.15,29.4 77.03,29.4 M.D.OA.P.TP
CM_OPAMP_P4
  Top 0.127: U6.IN+ 69.66,10.7 R16.2 R17.2 71.83,11.54 72.13,11.54 72.88,10.79 M.P.OA.P.TP
CM_PROC_DCBIAS_SHUTDOWN  (via drill 0.2)
  Top 0.102: v72.95,2.82 72.95,1.98 M.P.SDN.TP | v39.32,34.44 39.32,35.79 v39.25,35.85 | v43.84,57.48 43.84,57.45 v45.29,56.01
  Top 0.127: M.P.SDN.TP 72.39,1.91 v71.75,2.54
  Bottom 0.102: v72.95,2.82 72.95,2.64 74.14,1.45 74.14,1.12 74.23,1.03 75.63,1.03 75.87,1.27 78.74,1.27 82.55,5.08 82.55,60.6 81.56,61.59 43.81,61.59 43.81,57.51 v43.84,57.48 | U_INSTR_PROC.16 37.38,31.58 38.8,33 39.09,33 39.32,33.22 v39.32,34.44 | v39.25,35.85 39.06,36.04 39.06,36.23 38.73,36.56 38.73,45.49 45.84,52.6 45.84,55 45.29,55.55 v45.29,56.01
  Bottom 0.127: Q4.G 66.94,4.23 R21.1 67.63,3.68 68.07,3.24 71.05,3.24 v71.75,2.54
CM_PROC_DIFFAMP_GAIN0  (via drill 0.2)
  Top 0.102: v71.73,13.59 66.42,13.59 v66.04,13.97
  Bottom 0.102: U_INSTR_PROC.66 49.46,8.02 54.78,8.02 59.92,13.16 59.92,26.34 58.93,27.33 58.93,29.66 59.05,29.78 62.56,29.78 62.92,29.43 62.92,27.47 62,26.55 62,19.49 62.35,19.14 62.35,17.09 62.23,16.97 62.23,15.24 62.87,14.61 66.04,14.61 v66.04,13.97 | U5.GS0 72.69,11.61 73.86,12.78 74.01,12.78 74.1,12.87 74.1,13.8 74.01,13.89 73.08,13.89 72.78,13.59 v71.73,13.59
CM_PROC_DIFFAMP_GAIN1  (via drill 0.2)
  Top 0.102: v66.42,14.4 66.42,14.05 70.97,14.05 v71.22,14.3
  Bottom 0.102: U_INSTR_PROC.65 49.46,8.52 54.99,8.52 59.69,13.22 59.69,20.55 59.71,20.57 59.71,26.25 58.73,27.24 58.73,29.75 58.96,29.98 62.65,29.98 63.12,29.51 63.12,27.38 62.2,26.47 62.2,19.57 62.56,19.22 62.56,17.01 62.43,16.88 62.43,15.52 63.14,14.81 66.12,14.81 66.24,14.69 66.24,14.58 v66.42,14.4 | U5.GS1 73.34,11.82 74.3,12.79 74.3,13.88 74.09,14.09 71.43,14.09 v71.22,14.3
CM_PROC_DIFFAMP_OUT  (via drill 0.2)
  Top 0.102: v59.54,4.27 60.05,4.27 60.33,4.55 60.33,26.67 59.36,27.64 59.36,29.36 59.38,29.39 62.41,29.39 62.51,29.29 62.51,27.61 61.57,26.67 61.57,18.55 61.19,18.17 61.19,10.69 | M.P.DA.VO.TP 78.05,1.91 76.56,0.42 70.04,0.42 61.19,9.27 61.19,10.67 | 61.19,10.67 61.19,10.69 | 61.19,10.67 61.21,10.67 61.19,10.69
  Top 0.127: M.P.DA.VO.TP 77.47,3.17 74.93,3.17 72.03,6.07 v72.03,6.15
  Bottom 0.102: U_INSTR_PROC.78 44.88,4.19 44.93,4.24 59.51,4.24 v59.54,4.27
  Bottom 0.127: v72.03,6.15 72.58,6.69 U5.OUT
CM_PROC_V_OFFSET_IN
  Top 0.102: R16.1 67.7,13.13 66.34,13.13 65.66,13.81 65.66,14.18 66.67,15.19 66.67,21.61 U11.1
  Top 0.127: R16.1 68.9,12.06 69.34,12.51 69.97,13.14 75.89,13.14 76.2,12.84 76.97,12.84 M.P.VOI.TP
CM_PROC_V_SENSE_N  (via drill 0.2)
  Top 0.102: J_DBG_TO_MAIN_HDR.14 43.67,39.29 43.67,39.57 43.76,39.66 43.81,39.66 v43.81,40.01 | v67.06,28.83 67.06,15.34 67.54,14.86 67.62,14.86 v67.72,14.96 | R17.1 71.69,12.58 v71.69,12.72
  Top 0.127: M.P.VN.TP 80.01,12.7 78.99,11.68 72.46,11.68 72.2,11.94 R17.1
  Bottom 0.102: v43.81,40.01 43.81,38.64 43.75,38.58 43.75,38.33 43.61,38.18 43.61,38.02 43.81,37.81 43.81,37.47 46.99,34.29 47.34,34.29 47.54,34.09 58.4,34.09 58.8,33.68 58.8,32.72 59.25,32.27 62.67,32.27 63.12,32.72 63.12,34.72 69.65,34.72 69.65,31.16 68.68,31.16 68.59,31.07 68.59,29.85 68.17,29.44 67.91,29.44 67.31,28.83 v67.06,28.83 | v67.72,14.96 67.72,14.03 Q3.D | v71.69,12.72 70.66,13.76 70.66,13.8
  Bottom 0.127: 70.66,13.8 Q3.D
CM_PROC_V_SENSE_P
  Bottom 0.127: R23.1 74.93,3.06 JP.P.PROC.2
CM_STORAGE_DCBIAS_SHUTDOWN  (via drill 0.2)
  Top 0.102: M.S.SDN.TP 75.06,44.45 75.64,43.87 77.41,43.87 v78.1,43.18 | v38.48,33.83 v38.48,35.99 | v45.34,54.97 44.78,55.52 44.65,55.52 44.5,55.67 v44.5,55.85
  Top 0.127: M.S.SDN.TP 68.07,44.45 v67.06,45.47
  Bottom 0.102: v78.1,43.18 81.91,43.18 82.14,43.41 82.14,60.3 82.12,60.33 81.25,61.19 44.8,61.19 | 44.7,61.19 44.8,61.19 | U_INSTR_PROC.14 36.38,31.3 38.48,33.4 v38.48,33.83 | v38.48,35.99 38.3,36.17 38.3,45.64 45.09,52.42 45.09,54.71 v45.34,54.97 | v44.5,55.85 44.68,56.03 44.68,61.07 44.8,61.19
  Bottom 0.127: Q6.G 66.86,47.4 R37.1 67.06,46.03 v67.06,45.47
CM_STORAGE_DIFFAMP_GAIN0  (via drill 0.2)
  Top 0.102: v58.9,10.79 59.05,10.95 59.05,26.19 58.14,27.11 58.14,29.87 58.88,30.61 66.17,30.61 70.74,35.18 74.45,35.18 74.67,35.4 74.67,40.8 74.45,41.02 73.28,41.02 72.39,41.91 v72.39,43.81
  Bottom 0.102: U_INSTR_PROC.116 29.61,8.49 33.66,4.45 56.52,4.45 59.05,6.99 59.05,9.25 58.9,9.4 v58.9,10.79 | 71.03,45.81 72.39,44.45 v72.39,43.81
  Bottom 0.127: U9.GS0 72.69,51.65 72.63,51.6 72.63,49.77 70.78,47.91 68.71,47.91 67.34,46.55 67.34,45.91 67.44,45.81 71.03,45.81
CM_STORAGE_DIFFAMP_GAIN1  (via drill 0.2)
  Top 0.102: v55.76,10.58 56.45,10.58 56.99,10.03 59.46,10.03 59.49,10.06 59.49,26.36 58.55,27.3 58.55,29.7 59.05,30.2 67.23,30.2 67.82,30.79 67.82,31.17 71.58,34.92 74.62,34.92 79.39,39.69 79.39,45.01 79.3,45.1 79.2,45.1 75.19,49.12 v75.19,49.29
  Top 0.127: v74.38,50.8 73.66,50.8 v73.03,51.44
  Bottom 0.102: v55.76,10.58 55.52,10.82 49.6,10.82 U_INSTR_PROC.60
  Bottom 0.127: v75.19,49.29 75.19,49.99 v74.38,50.8 | v73.03,51.44 73.03,52.16 73.08,52.21 73.08,52.74 U9.GS1
CM_STORAGE_DIFFAMP_OUT  (via drill 0.2)
  Top 0.102: v56.64,3.66 56.71,3.66 57.9,4.85 59.89,4.85 59.92,4.88 59.92,26.5 58.95,27.47 58.95,29.53 59.22,29.79 68.02,29.79 68.66,30.43 68.66,31.11 71.96,34.42 75.03,34.42 80.64,40.03 M.S.DA.VO.TP
  Top 0.127: v73.66,49.68 75.42,49.68 M.S.DA.VO.TP
  Bottom 0.102: U_INSTR_PROC.83 42.38,2.27 43.2,1.45 48.73,1.45 51.11,3.83 56.64,3.83 v56.64,3.66
  Bottom 0.127: v73.66,49.68 73.5,49.52 73.03,49.52 72.69,49.17 U9.OUT
CM_STORAGE_V_OFFSET_IN  (via drill 0.2)
  Top 0.102: U11.4 64.27,25.25 65.61,26.59 65.61,27.59 v65.96,27.94 | v66.04,33.93 66.04,35.41 v65.96,35.48 | v69.93,53.77 69.93,54.5 R24.1
  Top 0.127: R24.1 70.17,54.61 71.22,55.66 72.78,55.66 73.2,55.24 M.S.VOI.TP
  Bottom 0.102: v65.96,27.94 66.04,28.02 v66.04,33.93 | v65.96,35.48 65.96,47.43 65.73,47.66 65.73,53.64 65.82,53.73 69.83,53.73 69.9,53.8 v69.93,53.77
CM_STORAGE_V_SENSE_N  (via drill 0.2)
  Top 0.102: J_DBG_TO_MAIN_HDR.18 44.45,39.05 44.45,38.64 44.51,38.58 44.51,38.26 44.45,38.2 44.45,38.1 v44.52,38.02 | v66.04,55.88 65.41,55.88 64.13,54.61 64.13,53.08 63.98,53.08 63.76,52.86 63.76,52.55 63.93,52.37 63.93,50.9 63.92,50.89 63.92,47.36 64.13,47.14 v64.13,44.45
  Top 0.127: v71.75,55.24 72.84,55.24 R33.1 76.2,54.61 76.26,54.55 77.41,54.55 77.47,54.61 78.74,54.61 M.S.VN.TP
  Bottom 0.102: v44.52,38.02 48.06,34.49 58.56,34.49 59.21,33.85 59.21,32.88 59.42,32.68 62.5,32.68 62.71,32.88 62.71,43.66 63.5,44.45 v64.13,44.45 | v66.04,55.88 66.5,55.88 Q5.D
  Bottom 0.127: Q5.D 71.59,55.08 v71.75,55.24
CM_STORAGE_V_SENSE_P
  Bottom 0.127: R39.1 72.91,45.09 74.3,43.7 JP.P.STOR.2
CM_TEMP_DCBIAS_SHUTDOWN  (via drill 0.2)
  Top 0.102: M.T.SDN.TP 63.93,53.77 63.93,54.69 64.13,54.9 v64.13,57.15 | v38.1,34.29 v38.1,35.56
  Top 0.127: v62.87,51.44 M.T.SDN.TP
  Bottom 0.102: v64.13,57.15 64.13,60.33 63.48,60.98 44.88,60.98 44.88,52.5 38.1,45.72 v38.1,35.56 | U_INSTR_PROC.13 35.88,31.44 38.1,33.66 v38.1,34.29
  Bottom 0.127: Q10.G 57.38,46.54 R57.1 62.87,49.59 v62.87,51.44
CM_TEMP_DIFFAMP_GAIN0  (via drill 0.2)
  Top 0.102: 58.98,45.72 59.05,45.72 | 58.98,45.72 58.58,46.12 55.21,46.12 54.02,47.31 54.02,48.85 v53.97,48.9 | 58.98,45.72 59.62,45.09 62.51,45.09 62.61,44.98 62.89,44.98 63.42,44.45 63.42,38.56 v67.64,34.34 | v67.82,31.72 67.82,31.45 67.62,31.25 67.62,30.87 67.15,30.4 58.96,30.4 58.34,29.78 58.34,27.21 59.28,26.27 59.28,10.44 59.08,10.24 57.08,10.24 56.53,10.78 56.4,10.78 v56.19,11
  Bottom 0.102: U14.GS0 53.68,49.19 v53.97,48.9 | 49.46,11.52 U_INSTR_PROC.59 49.56,11.36 55.82,11.36 v56.19,11 | v67.82,31.72 67.82,34.03 67.64,34.21 v67.64,34.34
CM_TEMP_DIFFAMP_GAIN1  (via drill 0.2)
  Top 0.102: v64.82,33.96 63.12,35.66 63.12,44.42 62.76,44.78 59.63,44.78 59.33,45.09 50.94,45.09 50.87,45.16 v50.87,46.35
  Bottom 0.102: U_INSTR_PROC.55 49.46,13.52 50.34,13.52 52.02,11.84 57.42,11.84 59.08,13.49 59.08,26.02 58.12,26.99 58.12,30 58.71,30.59 63.39,30.59 63.68,30.3 65.2,30.3 65.2,31.42 64.82,31.8 v64.82,33.96 | U14.GS1 53.95,52.11 54.47,52.11 54.56,52.02 54.56,48.94 53.97,48.36 53.97,48.26 52.97,48.26 52.66,48.57 51.14,48.57 51.05,48.48 51.05,46.45 50.95,46.35 v50.87,46.35
CM_TEMP_DIFFAMP_OUT  (via drill 0.2)
  Top 0.102: v56.08,3.46 56.26,3.63 56.26,3.82 57.52,5.08 59.69,5.08 59.69,26.44 58.75,27.38 58.75,29.61 59.13,30 67.69,30 68.2,30.5 v68.2,30.58 | v60.88,49.38 60.88,49.3 63.63,46.56 63.63,38.91 65.53,37.01 | 65.53,36.98 65.53,37.01 | v68.2,34.34 65.53,37.01
  Top 0.127: M.T.DA.VO.TP 59.05,55.88 59.05,52.07 58.73,51.74 v56.93,51.74
  Bottom 0.102: U_INSTR_PROC.84 41.98,2.84 41.98,2.12 42.88,1.22 48.79,1.22 51.17,3.61 55.93,3.61 | 55.93,3.61 56.08,3.61 | 55.93,3.61 v56.08,3.46 | v68.2,30.58 v68.2,34.34 68.2,34.37 | v60.88,49.38 60.12,50.14 57.43,50.14 56.93,50.64 v56.93,51.74
  Bottom 0.127: v56.93,51.74 U14.OUT
CM_TEMP_V_OFFSET_IN  (via drill 0.2)
  Top 0.102: v58.42,45.74 52.23,45.74 R40.1 | v65.41,35.3 v65.41,33.93 | v65.41,27.94 65.41,26.67 63.5,24.77 63.5,22.79 U11.5
  Top 0.127: M.T.VOI.TP 49.53,56.52 49.53,48.45 R40.1
  Bottom 0.102: v58.42,45.74 58.44,45.72 63.5,45.72 65.41,43.81 v65.41,35.3 65.41,35.13 | v65.41,33.93 v65.41,27.94
CM_TEMP_V_SENSE_N  (via drill 0.2)
  Top 0.102: J_DBG_TO_MAIN_HDR.20 44.88,39.02 44.88,38.49 45.09,38.28 v45.09,38.1
  Top 0.127: M.T.VN.TP 50.16,57.84 50.74,57.84 50.86,57.73 50.86,56.57 50.74,56.46 50.42,56.46 50.42,51 50.71,50.71 50.66,50.66 | 50.66,50.66 50.59,50.72 v50.11,50.24 | 50.66,50.66 R53.1
  Bottom 0.102: v45.09,38.1 48.49,34.7 58.65,34.7 59.41,33.93 59.41,32.97 59.5,32.88 62.42,32.88 62.51,32.97 62.51,44.86 62,45.36 51.33,45.36 51.28,45.41 51.14,45.41 51.05,45.5 51.05,45.64 Q9.D
  Bottom 0.127: Q9.D 49.7,49.83 v50.11,50.24
CM_TEMP_V_SENSE_P
  Bottom 0.127: JP.P.TEMP.2 62.34,53.23 R59.1
DGND  (via drill 0.2)  (280 unrouted)
  Top 0.127: J5.A12 11,39.8 J5.B1 J5.GND | J5.GND1 J5.B12 11,45.3 J5.A1 12.38,45.11 12.87,45.11 13.16,44.81 D2.3 | R42.1 VR3.2 | R43.1 VR4.2 | J3.5 16.51,20.17 15.7,20.98 15.7,21.97 | J.USB.MN.GND 5.99,29.16 5.99,28.6 6.3,28.3 J.USB.MN.S4 | v60.96,3 59.03,1.07 50.34,1.07 47.45,3.96 47.45,4.42 C22.2 | 3.25,26.06 3.2,26.01 J.USB.MN.S1 3.15,26.06
  Top 0.152: J.USB.DBG.GND 6.3,14.25 J.USB.DBG.S4 | v41.68,40.97 41.68,41.73 J_DBG_TO_MAIN_HDR.3 41.54,42.66 41.58,42.7
  Top 0.254: C3.2 32.2,40.83 C205.2
  Bottom 0.127: 31.75,45.72 U12.21 | v60.96,3 R1.1 | U13.29 13.31,27.94 13.31,26.98 12.34,26.01 12.34,25.76 U13.6 | C55.2 22.05,28.52
  Bottom 0.152: 28.61,14.01 29.21,14.61 | U_INSTR_PROC.126 28.34,13.49
  Bottom 0.254: U12.10 31.38,45.35 31.75,45.72 31.15,45.72 30.92,45.5 30.57,45.5 U12.11 | R204.1 R203.1 C18.2 26.86,49.34 26.95,49.44 26.95,49.61 v27.13,49.78
  other vias: 43.81,46.35 46.36,46.99 40,50.8 46.99,50.8 42.55,53.98 38.73,56.52 35.56,56.52 41.91,60.96 34.92,60.96 30.48,60.96 26.67,60.96 31.12,56.52 26.67,56.52 22.22,56.52 20.95,60.35 17.14,60.33 17.14,56.52 12.7,60.96 17.14,50.8 22.22,52.7 24.13,46.35 24.13,50.8 29.21,49.53 29.21,47.62 34.92,50.16 34.29,42.55 39.37,41.27 44.86,40.34 43.28,36.8 43.81,33.66 43.18,28.57 43.18,31.75 47.62,31.75 48.26,26.04 45.09,26.04 46.36,19.05 44.45,17.14 40,17.14 35.56,17.14 31.75,17.14 29.21,17.14 29.9,12.55 35.56,13.34 35.56,9.53 29.84,9.53 32.18,4.47 41.91,5.08 42.55,6.99 45.72,6.99 44.45,10.79 43.18,12.7 51.44,5.71 53.97,5.71 56.52,5.71 57.78,6.99 57.78,8.89 53.97,7.62 51.44,7.62 53.97,10.16 51.44,1.91 53.97,1.91 56.52,1.91 24.77,4.45 21.59,4.45 16.51,4.45 16.51,6.35 21.59,6.35 16.51,10.16 13.97,6.99 12.4,8.61 1.91,5.08 6.02,5.08 5.71,8.26 1.91,8.26 1.91,10.16 5.71,10.16 3.18,14.61 3.18,17.14 3.18,29.21 3.18,31.75 1.91,22.86 5.71,22.86 5.08,25.4 6.98,25.4 10.16,22.86 10.16,20.32 13.33,20.95 19.05,20.95 20.95,19.05 20.95,17.14 22.22,13.34 19.68,10.79 23.5,10.79 31.12,21.59 28.57,23.5 26.04,19.68 26.04,22.23 19.68,26.04 22.22,26.04 8.25,34.29 10.16,36.2 6.35,36.2 13.97,40.01 15.24,39.37 18.01,39.37 18.03,41.27 15.88,41.91 13.97,44.45 20.32,43.81 13.97,46.99 13.97,50.8 8.25,48.26 3.81,48.26 4.45,54.61 10.79,50.8 10.79,56.52 10.79,53.34 55.88,36.2 57.15,32.38 53.97,38.1 52.07,40.01 50.16,41.91 55.24,42.55 58.42,39.37 57.78,14.61 57.78,19.05 57.78,22.86 57.78,26.04 57.15,29.84 53.97,32.38 53.97,29.21 52.07,27.94 50.22,32.69 41.27,36.83 46.36,59.69 46.36,57.78 46.99,54.61 39.37,48.26 40.64,46.35 43.81,52.07 45.09,50.8 37.47,41.91 39.37,37.47 35.71,36.47 38.33,26.92 35.18,26.9 34.92,29.21 38.73,29.21 28.57,26.04 31.12,26.04 33.02,9.53 29.21,3.17 29.06,5.36 14.25,12.34 15.7,11.28 11.94,13.44 41.38,52.2 44.35,49.17 52.07,14.61 52.07,12.7 19.46,6.25 51.05,19.38 49.05,3.4 11.96,31.98 13.87,31.98 16.48,24.69 17.17,25.4 50.8,12.06 10.69,31.34 7.72,30.91 15.39,34.65 48.11,17.88 48.06,11.25 16.79,27.69 12.37,24.84 17.65,30.35 13.33,36.22
  pour Bottom (rank 2): -1.27,-1.27 84.45,-1.27 84.45,63.5 -1.27,63.5
  pour Top (rank 2): -2.54,-2.54 85.72,-2.54 85.72,64.77 -2.54,64.77
ERASE_S  (via drill 0.2)
  Top 0.102: S.ERASE.2_2 64.98,0.98 64.4,1.56 63.77,1.56 63.19,0.98 S.ERASE.2_1 62.28,0.96 61.67,0.36 43.69,0.36 43.13,0.91 43.13,1.27 42.72,1.68 33.07,1.68 29.57,5.18 29.57,5.84 26.16,9.25 v26.16,9.5
  Bottom 0.102: v26.16,9.5 26.16,14.33 27.28,15.44 27.79,15.44 U_INSTR_PROC.130
EXT_VIN